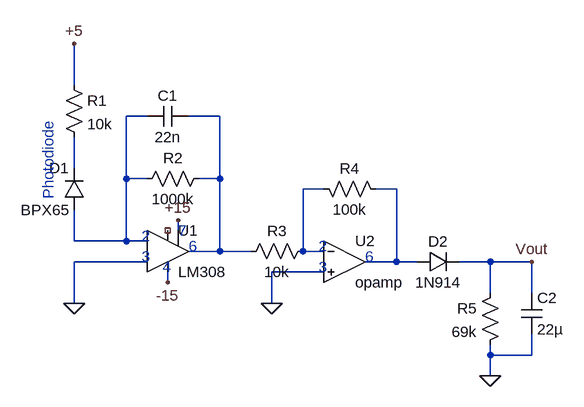
[diagram p0: schematic photodiode_amplifier.asc]
photodiode_amplifier.asc, the LTspice schematic file:
Version 4
SHEET 1 880 680
WIRE 112 -64 112 -128
WIRE 224 -16 192 -16
WIRE 336 -16 288 -16
WIRE 112 64 112 16
WIRE 192 80 192 -16
WIRE 224 80 192 80
WIRE 336 80 336 -16
WIRE 336 80 304 80
WIRE 496 96 464 96
WIRE 608 96 576 96
WIRE 272 160 272 144
WIRE 112 176 112 128
WIRE 192 176 192 80
WIRE 192 176 112 176
WIRE 224 176 192 176
WIRE 336 192 336 80
WIRE 336 192 288 192
WIRE 384 192 336 192
WIRE 464 192 464 96
WIRE 496 192 464 192
WIRE 224 208 112 208
WIRE 608 208 608 96
WIRE 608 208 560 208
WIRE 640 208 608 208
WIRE 752 208 704 208
WIRE 816 208 752 208
WIRE 496 224 416 224
WIRE 256 240 256 224
WIRE 752 256 752 208
WIRE 816 256 816 208
WIRE 112 272 112 208
WIRE 416 272 416 224
WIRE 752 352 752 336
WIRE 816 352 816 320
WIRE 816 352 752 352
WIRE 752 384 752 352
FLAG 112 272 0
FLAG 272 144 +15
FLAG 256 240 -15
FLAG 112 -128 +5
FLAG 416 272 0
FLAG 752 384 0
FLAG 816 208 Vout
SYMBOL Opamps\\LM308 256 128 R0
SYMATTR InstName U1
SYMBOL diode 128 128 R180
WINDOW 0 24 64 Left 2
WINDOW 3 24 0 Left 2
SYMATTR InstName D1
SYMATTR Value BPX65
SYMBOL res 96 -80 R0
SYMATTR InstName R1
SYMATTR Value 10k
SYMBOL res 208 96 R270
WINDOW 0 32 56 VTop 2
WINDOW 3 0 56 VBottom 2
SYMATTR InstName R2
SYMATTR Value 1000k
SYMBOL cap 224 -32 M90
WINDOW 0 0 32 VBottom 2
WINDOW 3 32 32 VTop 2
SYMATTR InstName C1
SYMATTR Value 22n
SYMBOL Opamps\\opamp 528 144 R0
SYMATTR InstName U2
SYMBOL res 368 208 R270
WINDOW 0 32 56 VTop 2
WINDOW 3 0 56 VBottom 2
SYMATTR InstName R3
SYMATTR Value 10k
SYMBOL res 592 112 M270
WINDOW 0 32 56 VTop 2
WINDOW 3 0 56 VBottom 2
SYMATTR InstName R4
SYMATTR Value 100k
SYMBOL diode 640 224 R270
WINDOW 0 32 32 VTop 2
WINDOW 3 0 32 VBottom 2
SYMATTR InstName D2
SYMATTR Value 1N914
SYMBOL res 768 240 M0
SYMATTR InstName R5
SYMATTR Value 69k
SYMBOL cap 800 256 R0
SYMATTR InstName C2
SYMATTR Value 22µ
TEXT 72 112 VLeft 2 ;Photodiode
TEXT 216 168 Left 2 ;2
TEXT 216 200 Left 2 ;3
TEXT 248 216 Left 2 ;4
TEXT 288 184 Left 2 ;6
TEXT 272 160 Left 2 ;7
TEXT 488 184 Left 2 ;2
TEXT 488 216 Left 2 ;3
TEXT 560 200 Left 2 ;6

The netlist it stands for:
* photodiode_amplifier.asc
XU1 0 N001 +15 -15 N002 NC_01 NC_02 LT1008
D1 N001 N003 BPX65
R1 +5 N003 10k
R2 N001 N002 1000k
C1 N001 N002 22n
XU2 N004 0 N005 opamp Aol=100K GBW=10Meg  ; pins invin noninvin out
R3 N002 N004 10k
R4 N005 N004 100k
D2 N005 Vout 1N914
R5 Vout 0 69k
C2 Vout 0 22µ
.model D D
.lib standard.dio
* Photodiode
* 2
* 3
* 4
* 6
* 7
* 2
* 3
* 6
.lib LTC.lib
.backanno
.end